# EAGLE design MaTouch ESP32-S3 Rotary IPS Display with Touch 2.1“ ST7701 v1.1 (EAGLE 6.1)
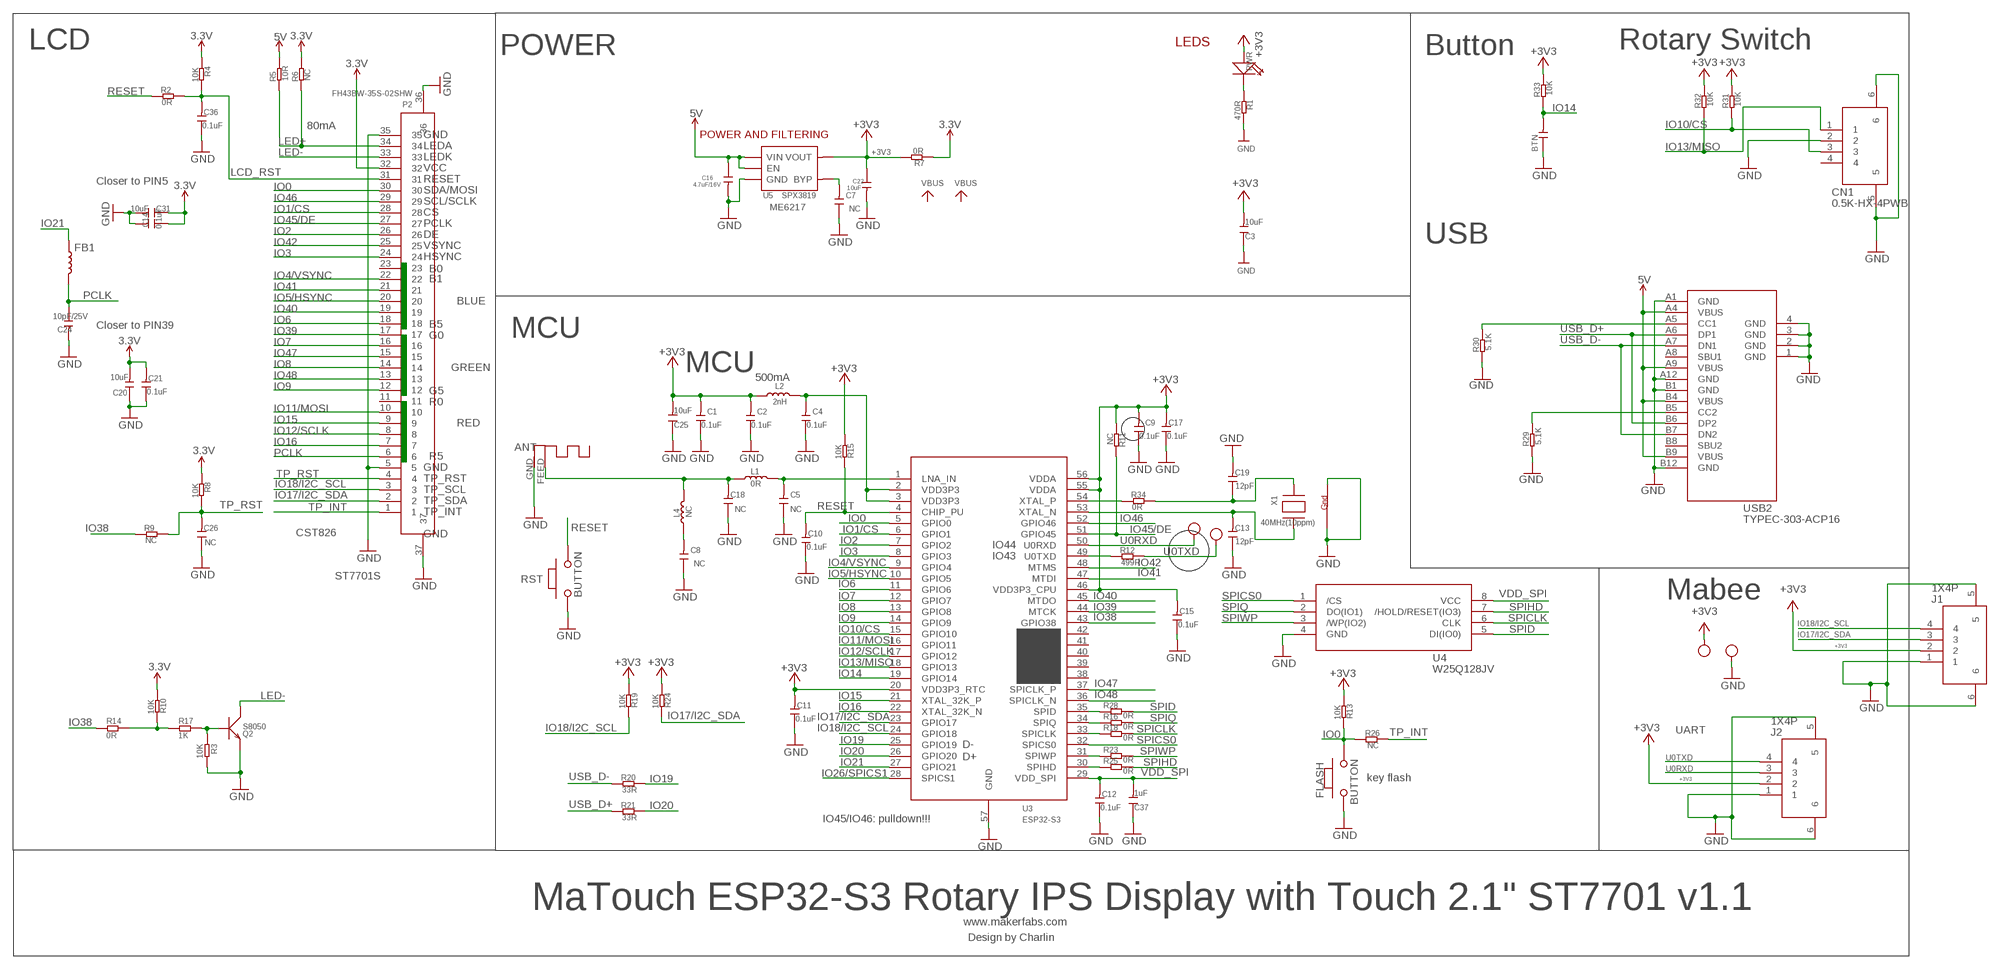
[diagram p0: schematic, sheet 1]

## Parts
3V3  TEST-POINT'4545'  [TP-D45MIL]
ANT1  ANTENNA  [RN-ANT]
BTN  C'5.08'  [CERAMIC-5.08]
C1  0.1uF  DISCRETE_C-0402  [DISCRETE_C0402]
C2  0.1uF  DISCRETE_C-0402  [DISCRETE_C0402]
C3  10uF  DISCRETE_C-0603  [DISCRETE_C0603]
C4  0.1uF  DISCRETE_C-0402  [DISCRETE_C0402]
C5  NC  DISCRETE_C-0402  [DISCRETE_C0402]
C7  NC  DISCRETE_C-0402  [DISCRETE_C0402]
C8  NC  DISCRETE_C-0402  [DISCRETE_C0402]
C9  0.1uF  DISCRETE_C-0402  [DISCRETE_C0402]
C10  0.1uF  DISCRETE_C-0402  [DISCRETE_C0402]
C11  0.1uF  DISCRETE_C-0402  [DISCRETE_C0402]
C12  0.1uF  DISCRETE_C-0402  [DISCRETE_C0402]
C13  12pF  DISCRETE_C-0402  [DISCRETE_C0402]
C14  0.1uF  DISCRETE_C-0402  [DISCRETE_C0402]
C15  0.1uF  DISCRETE_C-0402  [DISCRETE_C0402]
C16  4.7uF/16V  C-0603  [0603]
C17  0.1uF  DISCRETE_C-0402  [DISCRETE_C0402]
C18  NC  DISCRETE_C-0402  [DISCRETE_C0402]
C19  12pF  DISCRETE_C-0402  [DISCRETE_C0402]
C20  10uF  DISCRETE_C-0603  [DISCRETE_C0603]
C21  0.1uF  DISCRETE_C-0402  [DISCRETE_C0402]
C22  10uF  C-0603  [0603]
C24  10pF/25V  DISCRETE_C-0402  [DISCRETE_C0402]
C25  10uF  DISCRETE_C-0603  [DISCRETE_C0603]
C26  NC  DISCRETE_C-0402  [DISCRETE_C0402]
C31  10uF  DISCRETE_C-0603  [DISCRETE_C0603]
C36  0.1uF  DISCRETE_C-0402  [DISCRETE_C0402]
C37  1uF  DISCRETE_C-0603  [DISCRETE_C0603]
CN1  0.5K-HX-4PWB  [0.5K-HX-4PWB]
FB1  INDUCTORFB-30OHM  [0603]
FLASH  BUTTON  PB157  [157SW]
GND  TEST-POINT'4545'  [TP-D45MIL]
J1  1X4P  [1X4P-SMT1.25MM]
J2  1X4P  [1X4P-SMT1.25MM]
L1  0R  DISCRETE_L0402  [DISCRETE_L0402]
L2  2nH  DISCRETE_L0603  [DISCRETE_L0603]
L4  NC  DISCRETE_L0402  [DISCRETE_L0402]
P2  FH43BW-35S-02SHW  [1*35P-SMT0.4MM]
PWR  DISCRETE_LED0603  [DISCRETE_LED-0603]
Q2  S8050  TRANSISTOR-NPN-SOT23  [SOT23]
R1  470R  DISCRETE_R-0402  [DISCRETE_R0402]
R2  0R  DISCRETE_R-0402  [DISCRETE_R0402]
R3  10K  DISCRETE_R-0402  [DISCRETE_R0402]
R4  10K  DISCRETE_R-0402  [DISCRETE_R0402]
R5  10R  DISCRETE_R-0402  [DISCRETE_R0402]
R6  NC  DISCRETE_R-0402  [DISCRETE_R0402]
R7  0R  DISCRETE_R-0402  [DISCRETE_R0402]
R8  10K  DISCRETE_R-0402  [DISCRETE_R0402]
R9  NC  DISCRETE_R-0402  [DISCRETE_R0402]
R10  10K  DISCRETE_R-0402  [DISCRETE_R0402]
R11  NC  DISCRETE_R-0402  [DISCRETE_R0402]
R12  499R  DISCRETE_R-0402  [DISCRETE_R0402]
R13  10K  DISCRETE_R-0402  [DISCRETE_R0402]
R14  0R  DISCRETE_R-0402  [DISCRETE_R0402]
R15  10K  DISCRETE_R-0402  [DISCRETE_R0402]
R16  0R  DISCRETE_R-0402  [DISCRETE_R0402]
R17  1K  DISCRETE_R-0402  [DISCRETE_R0402]
R18  0R  DISCRETE_R-0402  [DISCRETE_R0402]
R19  10K  DISCRETE_R-0402  [DISCRETE_R0402]
R20  33R  DISCRETE_R-0402  [DISCRETE_R0402]
R21  33R  DISCRETE_R-0402  [DISCRETE_R0402]
R23  0R  DISCRETE_R-0402  [DISCRETE_R0402]
R24  10K  DISCRETE_R-0402  [DISCRETE_R0402]
R25  0R  DISCRETE_R-0402  [DISCRETE_R0402]
R26  NC  DISCRETE_R-0402  [DISCRETE_R0402]
R28  0R  DISCRETE_R-0402  [DISCRETE_R0402]
R29  5.1K  DISCRETE_R-0402  [DISCRETE_R0402]
R30  5.1K  DISCRETE_R-0402  [DISCRETE_R0402]
R31  10K  DISCRETE_R-0402  [DISCRETE_R0402]
R32  10K  DISCRETE_R-0402  [DISCRETE_R0402]
R33  10K  DISCRETE_R-0402  [DISCRETE_R0402]
R34  0R  DISCRETE_R-0402  [DISCRETE_R0402]
RST  BUTTON  PB157  [157SW]
RX  TEST-POINT'4545'  [TP-D45MIL]
TX  TEST-POINT'4545'  [TP-D45MIL]
U3  ESP32-S3  [QFN56-7*7MM]
U4  W25Q128JV  [SOIC-8-208MIL]
U5  SPX3819  [SOT23-5]
USB2  TYPEC-303-ACP16  [TYPEC-303-SMD16]
X1  40MHz(10ppm)  XTAL-4-3225  [NX3225]

## Nets
3.3V: C14.1 C20.2 C21.2 C31.1 P2.32 R4.2 R6.1 R7.2 R8.2 R10.2
5V: C16.1 R5.1 U5.1(VIN) U5.3(EN) USB2.A4(VBUS) USB2.A9(VBUS) USB2.B4(VBUS) USB2.B9(VBUS)
+3V3: 3V3.T C1.2 C2.2 C3.2 C9.2 C11.2 C15.2 C17.2 C22.1 C25.2 J1.2 J2.2 L2.1 PWR.+ R7.1 R11.2 R13.2 R15.2 R19.2 R24.2 R31.1 R32.1 R33.1 U3.20(VDD3P3_RTC) U3.46(VDD3P3_CPU) U3.55(VDDA) U3.56(VDDA) U5.5(VOUT)
GND: ANT1.GND BTN.1 C1.1 C2.1 C3.1 C4.1 C5.1 C7.1 C8.1 C9.1 C10.1 C11.1 C12.1 C13.1 C14.2 C15.1 C16.2 C17.1 C18.1 C19.2 C20.1 C21.1 C22.2 C24.2 C25.1 C26.1 C31.2 C36.1 C37.1 CN1.2 CN1.5 CN1.6 FLASH.1 GND.T J1.1 J1.5 J1.6 J2.1 J2.5 J2.6 P2.5 P2.35 P2.36 P2.37 Q2.2(E) R1.1 R3.1 R29.2 R30.2 RST.1 U3.57(GND) U4.4(GND) U5.2(GND) USB2.1(GND) USB2.2(GND) USB2.3(GND) USB2.4(GND) USB2.A1(GND) USB2.A12(GND) USB2.B1(GND) USB2.B12(GND) X1.2(G2) X1.4(G1)
IO0: FLASH.2 P2.30 R13.1 R26.2 U3.5(GPIO0)
IO1/CS: P2.28 U3.6(GPIO1)
IO2: P2.26 U3.7(GPIO2)
IO3: P2.24 U3.8(GPIO3)
IO4/VSYNC: P2.22 U3.9(GPIO4)
IO5/HSYNC: P2.20 U3.10(GPIO5)
IO6: P2.18 U3.11(GPIO6)
IO7: P2.16 U3.12(GPIO7)
IO8: P2.14 U3.13(GPIO8)
IO9: P2.12 U3.14(GPIO9)
IO10/CS: CN1.3 R31.2 U3.15(GPIO10)
IO11/MOSI: P2.10 U3.16(GPIO11)
IO12/SCLK: P2.8 U3.17(GPIO12)
IO13/MISO: CN1.1 R32.2 U3.18(GPIO13)
IO14: BTN.2 R33.2 U3.19(GPIO14)
IO15: P2.9 U3.21(XTAL_32K_P)
IO16: P2.7 U3.22(XTAL_32K_N)
IO17/I2C_SDA: J1.3 P2.2 R24.1 U3.23(GPIO17)
IO18/I2C_SCL: J1.4 P2.3 R19.1 U3.24(GPIO18)
IO19: R20.1 U3.25(GPIO19)
IO20: R21.1 U3.26(GPIO20)
IO21: FB1.1 U3.27(GPIO21)
IO26/SPICS1: U3.28(SPICS1)
IO38: R9.2 R14.2 U3.43(GPIO38)
IO39: P2.17 U3.44(MTCK)
IO40: P2.19 U3.45(MTDO)
IO41: P2.21 U3.47(MTDI)
IO42: P2.25 U3.48(MTMS)
IO45/DE: P2.27 R11.1 U3.51(GPIO45)
IO46: P2.29 U3.52(GPIO46)
IO47: P2.15 U3.37(SPICLK_P)
IO48: P2.13 U3.36(SPICLK_N)
LCD_RST: C36.2 P2.31 R2.1 R4.1
LED+: P2.34 R5.2 R6.2
LED-: P2.33 Q2.3(C)
N$1: ANT1.FEED C18.2 L1.1 L4.2
N$2: C5.2 L1.2 U3.1(LNA_IN)
N$3: R28.2 U3.35(SPID)
N$4: C8.2 L4.1
N$6: R10.1 R14.1 R17.2
N$7: PWR.- R1.2
N$8: Q2.1(B) R3.2 R17.1
N$9: R30.1 USB2.A5(CC1)
N$10: R29.1 USB2.B5(CC2)
N$33: C4.2 L2.2 U3.2(VDD3P3) U3.3(VDD3P3)
N$35: R16.2 U3.34(SPIQ)
N$37: R34.2 U3.54(XTAL_P)
N$38: R18.2 U3.33(SPICLK)
N$40: R23.2 U3.31(SPIWP)
N$41: R25.2 U3.30(SPIHD)
N$63: R12.2 U3.49(U0TXD)
N$65: C13.2 U3.53(XTAL_N) X1.3(X2)
N$66: C19.1 R34.1 X1.1(X1)
N$76: C7.2 U5.4(BYP)
PCLK: C24.1 FB1.2 P2.6
RESET: C10.2 R2.2 R15.1 RST.2 U3.4(CHIP_PU)
SPICLK: R18.1 U4.6(CLK)
SPICS0: U3.32(SPICS0) U4.1(/CS)
SPID: R28.1 U4.5(DI(IO0))
SPIHD: R25.1 U4.7(/HOLD/RESET(IO3))
SPIQ: R16.1 U4.2(DO(IO1))
SPIWP: R23.1 U4.3(/WP(IO2))
TP_INT: P2.1 R26.1
TP_RST: C26.2 P2.4 R8.1 R9.1
U0RXD: J2.3 RX.T U3.50(U0RXD)
U0TXD: J2.4 R12.1 TX.T
USB_D+: R21.2 USB2.A6(DP1) USB2.B6(DP2)
USB_D-: R20.2 USB2.A7(DN1) USB2.B7(DN2)
VDD_SPI: C12.2 C37.2 U3.29(VDD_SPI) U4.8(VCC)
Unconnected: CN1.4 P2.11 P2.23 U3.38(GPIO33) U3.39(GPIO34) U3.40(GPIO35) U3.41(GPIO36) U3.42(GPIO37) USB2.A8(SBU1) USB2.B8(SBU2)

## Notes on the sheet
- LCD | LEDS | Rotary Switch
- POWER | Button
- 80mA
- GND | POWER AND FILTERING
- LEDA
- LEDK
- VCC
- Closer to PIN5 | RESET
- SDA/MOSI
- SCL/SCLK
- ME6217
- CS
- PCLK
- DE
- USB
- VSYNC
- HSYNC
- B0
- B1
- BLUE
- Closer to PIN39 | B5
- G0 | MCU
- GREEN | MCU
- 500mA
- G5
- R0
- RED
- ANT
- R5
- GND
- TP_RST
- TP_SCL
- TP_SDA
- TP_INT
- CST826 | GND
- IO44
- IO43
- ST7701S
- Mabee
- UART
- D-
- D+
- key flash
- IO45/IO46: pulldown!!!
- MaTouch ESP32-S3 Rotary IPS Display with Touch 2.1" ST7701 v1.1
- www.makerfabs.com
- Design by Charlin

## Library data of the parts
3V3 GND RX TX = Discrete-new:TEST-POINT; PARTNO: DNP
ANT1 = adafruit:ANTENNA
BTN C16 C22 = Discrete:C*: Ceramic Capacitors
C1-C5 C7-C15 C17-C21 C24-C26 C31 C36 C37 = A9G:DISCRETE_C*: Ceramic Capacitors
CN1 = sale:0.5K-HX-4PWB
FB1 = SparkFun-Coils:INDUCTOR: Inductors Resist changes in electrical current. Basically a coil of wire. SparkFun Products: SparkFun Load Cell Amplifier - HX711 <https://www.sparkfun.com/products/13879> IOIO-OTG - V2.2 <https://www.sparkfun.com/products/13613>; PROD_ID: NDUC-07859
FLASH RST = MySMD:PB157
J1 J2 = sale:1X4P
L1 L2 L4 = A9G:DISCRETE_L*
P2 = sale:FH43BW-35S-02SHW
PWR = A9G:DISCRETE_LED*
Q2 = Discrete:TRANSISTOR-NPN*: NPN audion
R1-R21 R23-R26 R28-R34 = A9G:DISCRETE_R*
U3 = sale:ESP32-S3
U4 = self:W25Q128JV
U5 = IC:SPX3819
USB2 = sale:TYPEC-303-ACP16
X1 = adafruit:XTAL-4: Classic 4-pin 3.2 x 2.5mm crystal

## Net classes
0 default: width 0.203 mm, drill 0.305 mm, clearance 0.152 mm
1 vbat: width 0.254 mm, drill 0.305 mm, clearance 0.203 mm

## Board
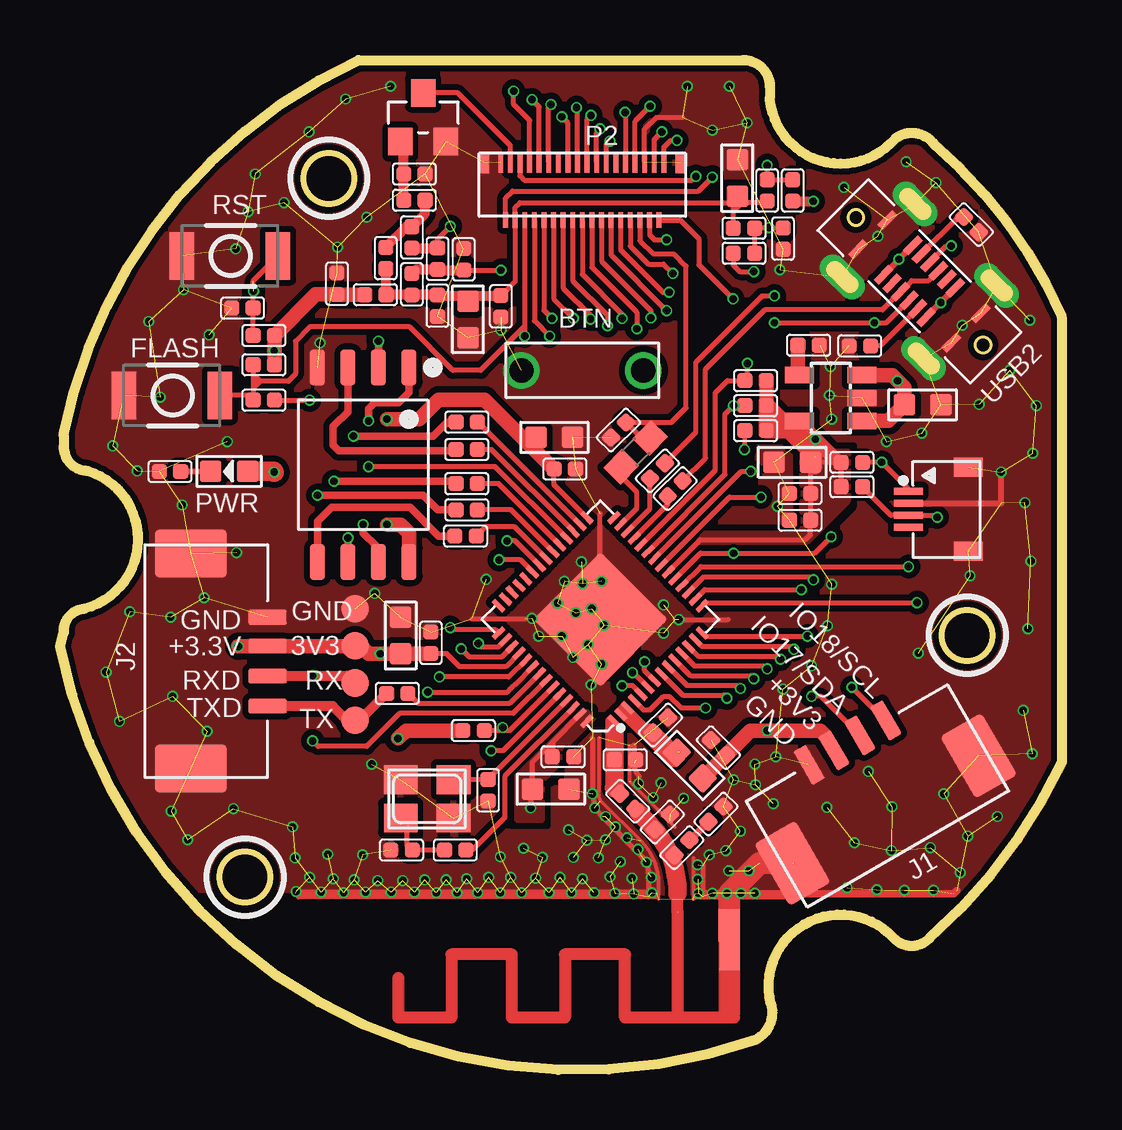
[diagram p1: board, top side]
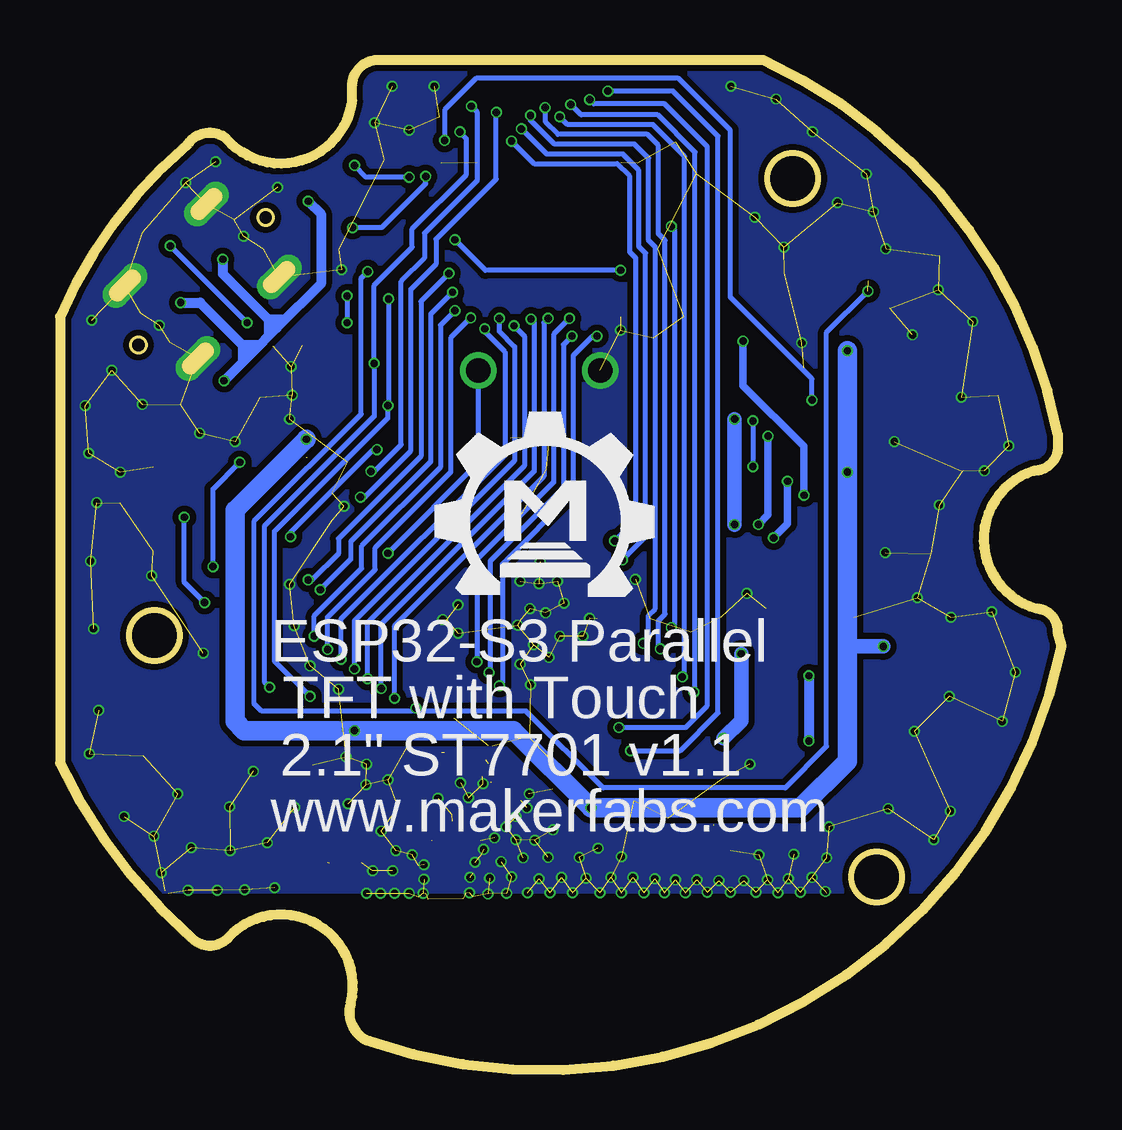
[diagram p2: board, bottom side, seen from below]

Size 41.75 x 42.08 mm. Coordinates in mm from the lower left corner, seen from the top.
Outline: 29.59,40.49 29.59,40.98 arc90 28.49,42.08 12.44,42.08 arc54 0.15,26.48
Outline: 29.58,40.45 arc134 34.84,38.83 arc-89 36.41,38.6 arc-26 41.75,31.39 41.75,12.79 arc-23 36.24,5.48
Outline: 36.24,5.48 arc-90 34.76,5.48 arc152 29.63,2.76 arc-79 29.02,1.27 arc-98 0,17.65 0.16,18.23 arc-90 1.03,19.22 arc147 1.16,24.96 arc-90 0.15,25.98 0.15,26.46
Outline: circle at 7.71,8.03 radius 1.05
Outline: circle at 11.21,37.15 radius 1.05
Outline: circle at 37.81,18.1 radius 1.05
Copper layers (1*16): Top 0.035mm / dielectric 1.5mm / Bottom 0.035mm
Design rules: minimum track width 6mil, minimum drill 10mil, track to track 6mil, track to pad 6mil, pad to pad 6mil, via to via 6mil, smd to smd 0mil, copper to edge 10mil, drill to drill 10mil, minimum pad ring 3mil, minimum via ring 3mil, stop-mask expansion 2mil, vias tented up to drill 100mil, thermal gap 0mil
tRestrict: area 0.2,-0.3 to 46.2,7.1
bRestrict: area 0.2,-0.3 to 46.2,7.1

### Footprints (pad centres in the part's own frame; a part is rotated, then mirrored left to right if it is on the bottom)
TP-D45MIL = smd 1.143 x 1.143: T 0,0
RN-ANT = smd 0.025 x 0.025: FEED 0,2.159 | smd 2.54 x 0.889: GND -1.143,0
CERAMIC-5.08 = drill 1.016: 1 -2.54,0; 2 2.54,0
DISCRETE_C0402 = smd 0.635 x 0.635: 1 -0.445,0; 2 0.445,0
DISCRETE_C0603 = smd 0.889 x 0.889: 1 -0.762,0; 2 0.762,0
0603 = smd 0.889 x 0.889: 1 -0.762,0; 2 0.762,0
0.5K-HX-4PWB = smd 0.3 x 1.2: 1 0.75,0; 2 0.25,0; 3 -0.25,0; 4 -0.75,0 | smd 0.8 x 1.2: 5 -1.75,-2.5; 6 1.75,-2.5
0603' = smd 1.1 x 1: 1 -0.85,0; 2 0.85,0
157SW = smd 1.016 x 1.981: 1 0,0; 2 4,0
1X4P-SMT1.25MM = smd 0.6 x 1.6: 1 -1.825,2.54; 2 -0.625,2.54; 3 0.625,2.54; 4 1.875,2.54 | smd 2 x 3: 5 4.475,-0.66; 6 -4.475,-0.66
DISCRETE_L0402 = smd 0.635 x 0.635: 1 -0.445,0; 2 0.445,0
DISCRETE_L0603 = smd 0.889 x 0.889: 1 -0.762,0; 2 0.762,0
1*35P-SMT0.4MM = smd 0.2 x 0.87: 1 -3.4,-1.26; 3 -3,-1.26; 5 -2.6,-1.26; 7 -2.2,-1.26; 9 -1.8,-1.26; 11 -1.4,-1.26; 13 -1,-1.26; 15 -0.6,-1.26; 17 -0.2,-1.26; 19 0.2,-1.26; 21 0.6,-1.26; 23 1,-1.26; 25 1.4,-1.26; 27 1.8,-1.26; 29 2.2,-1.26; 31 2.6,-1.26; 33 3,-1.26; 35 3.4,-1.26 | smd 0.2 x 0.65: 2 -3.2,1.15; 4 -2.8,1.15; 6 -2.4,1.15; 8 -2,1.15; 10 -1.6,1.15; 12 -1.2,1.15; 14 -0.8,1.15; 16 -0.4,1.15; 18 0,1.15; 20 0.4,1.15; 22 0.8,1.15; 24 1.2,1.15; 26 1.6,1.15; 28 2,1.15; 30 2.4,1.15; 32 2.8,1.15; 34 3.2,1.15 | smd 0.4 x 0.9: 36 -4.085,-1.245; 37 4.085,-1.245
DISCRETE_LED-0603 = smd 0.889 x 0.889: + -0.762,0; - 0.762,0
SOT23 = smd 1.016 x 1.143: 1 -0.95,-1.016; 2 0.95,-1.016; 3 0,1.016
DISCRETE_R0402 = smd 0.635 x 0.635: 1 -0.445,0; 2 0.445,0
QFN56-7*7MM = smd 0.6 x 0.2: 1 -3.4,2.6; 2 -3.4,2.2; 3 -3.4,1.8; 4 -3.4,1.4; 5 -3.4,1; 6 -3.4,0.6; 7 -3.4,0.2; 8 -3.4,-0.2; 9 -3.4,-0.6; 10 -3.4,-1; 11 -3.4,-1.4; 12 -3.4,-1.8; 13 -3.4,-2.2; 14 -3.4,-2.6; 29 3.4,-2.6; 30 3.4,-2.2; 31 3.4,-1.8; 32 3.4,-1.4; 33 3.4,-1; 34 3.4,-0.6; 35 3.4,-0.2; 36 3.4,0.2; 37 3.4,0.6; 38 3.4,1; 39 3.4,1.4; 40 3.4,1.8; 41 3.4,2.2; 42 3.4,2.6 | smd 0.2 x 0.6: 15 -2.6,-3.4; 16 -2.2,-3.4; 17 -1.8,-3.4; 18 -1.4,-3.4; 19 -1,-3.4; 20 -0.6,-3.4; 21 -0.2,-3.4; 22 0.2,-3.4; 23 0.6,-3.4; 24 1,-3.4; 25 1.4,-3.4; 26 1.8,-3.4; 27 2.2,-3.4; 28 2.6,-3.4; 43 2.6,3.4; 44 2.2,3.4; 45 1.8,3.4; 46 1.4,3.4; 47 1,3.4; 48 0.6,3.4; 49 0.2,3.4; 50 -0.2,3.4; 51 -0.6,3.4; 52 -1,3.4; 53 -1.4,3.4; 54 -1.8,3.4; 55 -2.2,3.4; 56 -2.6,3.4 | smd 4 x 4: 57 0,0
SOIC-8-208MIL = smd 1.5 x 0.635: 1 -4.05,1.905; 2 -4.05,0.635; 3 -4.05,-0.635; 4 -4.05,-1.905; 5 4.05,-1.905; 6 4.05,-0.635; 7 4.05,0.635; 8 4.05,1.905
SOT23-5 = smd 0.69 x 1.2: 1 -0.95,-1.3; 2 0,-1.3; 3 0.95,-1.3; 4 0.95,1.3; 5 -0.95,1.3
TYPEC-303-SMD16 = drill 0.6 pad 1.1 long: 1 -2.4,2.15; 2 2.4,2.15; 3 -2.4,-2.15; 4 2.4,-2.15 | smd 0.3 x 0.87: A1 -2.75,0.865; A4 -1.25,0.865; A5 -0.75,0.865; A6 -0.25,0.865; A7 0.25,0.865; A8 0.75,0.865; A9 1.25,0.865; A12 2.75,0.865; B1 2.75,-0.865; B4 1.25,-0.865; B5 0.75,-0.865; B6 0.25,-0.865; B7 -0.25,-0.865; B8 -0.75,-0.865; B9 -1.25,-0.865; B12 -2.75,-0.865
NX3225 = smd 1.4 x 1.2: 1 -1.1,-0.8; 2 1.1,-0.8; 3 1.1,0.8; 4 -1.1,0.8

### Placement (x,y rotation side)
3V3  12.31,17.67 0 top
ANT1  27.9,6.57 90 top
BTN  21.78,29.15 0 top
C1  20.97,13.05 180 top
C2  30.85,22.9 0 top
C3  30.52,25.32 0 top
C4  25.03,14.37 225 top
C5  23.56,12.92 180 top
C7  31.21,30.19 180 top
C8  27.35,10.66 225 top
C9  27.45,13.43 315 top
C10  7.61,31.74 0 top
C11  30.85,24.02 0 top
C12  21.05,25.04 180 top
C13  17.85,11.65 90 top
C14  18.38,31.82 270 top
C15  11.55,32.76 270 top
C16  35.96,27.71 0 top
C17  15.46,17.8 270 top
C18  25.11,10.33 225 top
C19  14.24,9.16 180 top
C20  17.01,31.28 90 top
C21  15.74,31.84 90 top
C22  14.2,18.1 90 top
C24  23.28,26.66 225 top
C25  20.46,11.7 180 top
C26  16.83,33.77 270 top
C31  28.24,37.16 90 top
C36  30.14,34.64 90 top
C37  20.61,26.36 180 top
CN1  35.36,23.36 90 top
FB1  [0603']  24,25.74 45 top
FLASH  2.67,28.1 0 top
GND  12.31,19.22 0 top
J1  34.08,11.42 30 top
J2  6.11,17.04 270 top
L1  23.66,11.19 135 top
L2  26.25,12.69 135 top
L4  25.92,9.26 225 top
P2  21.77,36.56 180 top
PWR  7.05,24.94 180 top
Q2  15.14,39.69 0 top
R1  4.59,24.94 0 top
R2  28.51,34.03 180 top
R3  14.77,37.33 180 top
R4  28.51,35.07 180 top
R5  30.55,36.64 90 top
R6  29.48,36.64 90 top
R7  13.15,32.3 0 top
R8  14.67,32.73 270 top
R9  15.74,33.8 90 top
R10  13.58,33.83 270 top
R11  17.24,14.14 180 top
R12  14.06,15.69 0 top
R13  8.5,29.38 0 top
R14  14.67,34.69 270 top
R15  8.5,30.6 0 top
R16  16.96,23.34 0 top
R17  14.77,36.24 0 top
R18  16.96,24.43 0 top
R19  29,28.72 0 top
R20  25.64,24.22 45 top
R21  24.91,24.96 45 top
R23  16.96,25.85 0 top
R24  29,27.68 0 top
R25  16.96,26.99 0 top
R26  8.5,27.91 180 top
R28  16.91,22.24 0 top
R29  37.99,35.22 315 top
R30  33.34,30.17 180 top
R31  33.01,24.3 0 top
R32  33.01,25.32 0 top
R33  29,26.64 180 top
R34  16.47,9.16 0 top
RST  5.09,33.91 0 top
RX  12.31,16.12 0 top
TX  12.31,14.57 0 top
U3  22.53,18.77 135 top
U4  12.64,25.21 270 top
U5  32.13,28 90 top
U$1  [MAKERFABS_0.3]  25.65,19.79 0 bottom
USB2  35.83,32.86 135 top
X1  15.31,11.3 0 top

### Tracks (layer width: path | path; a pad name or v marks a point on that pad's centre or on a via)
3.3V
  Top 0.203: C14.1 18.97,32.86 P2.32 18.97,35.94 19.17,36.14 28.42,36.14 | 13.6,32.29 R7.2 | 13.59,33.37 R10.2 | C21.2 15.76,32.26 | C20.2 17.08,32.11 17.08,32.26 | R6.1 29.42,36.14 28.42,36.14 | R4.2 28.07,35.78 | 28.07,35.78 28.07,36.23 C31.1 | 28.42,36.14 28.07,35.78
  Top 0.406: C21.2 R8.2 13.6,32.29 | R7.2 13.59,33.37 | 15.76,32.26 17.08,32.26 C14.1
5V  (via drill 0.3)
  Top 0.254: USB2.B4 v34.98,33.77 v34.97,33.77 | USB2.A4 36.71,31.97 v36.72,31.97 | v34.91,28.72 34.9,28.73
  Top 0.279: USB2.A4 USB2.B9 | USB2.A9 USB2.B4
  Top 0.406: R5.1 v31.4,36.2
  Top 0.61: U5.1 34.54,27.05 C16.1 35.2,28.44 34.9,28.73 34.69,28.95 U5.3
  Bottom 0.406: v31.4,36.2 30.88,35.67 30.88,32.75 32.72,30.91 | 32.72,30.91 33.78,29.85 | 33.78,29.85 v34.91,28.72 | v34.97,33.77 34.97,33.16 33.06,31.26 | 33.06,31.26 32.72,30.91 | v36.72,31.97 35.91,31.97 34.13,30.19 | 34.13,30.19 33.78,29.85 | 32.37,31.26 33.06,31.26 | 33.06,31.26 33.06,30.57 | 33.47,30.19 34.13,30.19 | 34.13,30.19 34.13,29.53
+3V3  (via drill 0.3)  (1 unrouted)
  Top 0.203: U3.20 26.7,22.09 31.08,22.09 31.28,22.29 31.28,22.89 C2.2 C11.2 31.29,25.3 C3.2 R32.1 R31.1 | U3.46 18.58,16.81 16.65,16.81 16.12,17.34 15.47,17.34 C17.2 | C22.1 | U3.55 20.53,13.66 | 20.53,13.66 C1.2 | v19.62,10.91 19.62,11.63 C25.2 19.7,12.83 20.53,13.66 | U5.5 30.98,26.91
  Top 0.61: v8.93,29.96 8.94,29.98 R15.2 | 15.47,17.34 C22.1 | v13.35,17.34 12.87,17.34 12.54,17.67 3V3.T 12.3,17.66 J2.2 7.45,17.66 v7.43,17.65 | v13.35,17.34 C22.1 v13.35,17.34 | R13.2 R15.2 | R15.2 10.66,32.31 C15.2 11.56,32.3 R7.1 | R11.2 14.42,14.14 v14.09,13.81 | R19.2 R24.2 29.44,27.17 | 29.44,27.17 R33.1 | U5.5 29.56,27.05 29.44,27.17 | 30.98,26.91 30.98,26.79 v31.49,26.28 31.49,25.52 C3.2 | 31.46,25.11 31.46,25.52 30.37,26.61 29.43,26.61 29.43,27.78 | 29.43,27.86 29.43,27.78 | 29.43,27.78 30.39,26.81 30.95,26.81 32.27,25.49 | L2.1 C9.2 28.79,14.14 v29.48,14.14 | v29.48,14.14 30.14,14.14 | v29.48,14.14 31.69,14.14 31.89,13.94 J1.2
  Top 0.813: PWR.+ 8.9,24.94 v8.93,24.91
  Bottom 0.61: v7.43,17.65 8.9,17.65 8.93,17.62 | v14.09,13.81 13.35,14.55 v13.35,17.34
  Bottom 0.813: v8.93,29.96 v8.93,24.91 8.93,17.62 8.93,12.87 10.89,10.91 v19.62,10.91 22.85,14.14 v29.48,14.14 34.08,14.14 34.46,14.52 34.46,23.31 v31.49,26.28
  pour Top: 21.81,15.08 19.04,12.31 19.04,10.41 20.11,10.41 20.11,12.03 20.84,12.77 20.84,13.25 22.24,14.65
  pour Top: 30.9,25.77 30.9,22.62 30.65,22.37 26.89,22.37 26.61,22.09 26.61,21.99 31.16,21.99 32.88,23.72 32.88,25.77
GND  (via drill 0.3)  (245 unrouted)
  Top 0.152: 22.47,13.84 22.47,11.4 arc45 22.54,11.22 24.21,9.55 arc-45 24.96,7.75 24.96,7.13 | 23.79,11.98 25.41,10.36 25.41,10.33 25.64,10.1 | 23.76,12.01 arc-90 23.74,12.08 23.74,13.51 23.92,13.51 23.92,13.53 | 26.41,8.83 26.41,7.1
  Top 0.203: P2.5 24.37,39.21 24.86,39.69 25.95,39.69 | U3.57 22.52,23.18 | 25.64,18.76 27.85,18.76 | 17.16,18.79 19.37,18.79 | 22.19,13.84 v22.19,11.5 | 22.21,11.5 arc45 22.61,10.54 24.22,8.93 arc-45 24.53,8.2 24.53,7.21 | 23.92,13.53 23.92,12.79 arc45 24.14,12.24 | 26.81,8.52 26.81,7.21 | 24.91,7.21 9.95,7.21 | 26.43,7.21 30.39,7.21
  Top 0.254: CN1.2 39.23,23.61 v39.23,24.91
  Top 0.305: 9.79,7.36 24.86,7.36 | 26.48,7.33 37.25,7.33 37.38,7.46
  Top 0.914: ANT1.GND 27.9,7.36 29.17,8.63 30.6,8.63
  other vias: 8.14,37.33 35.27,37.84 3.7,31.18 11.9,40.45 26.15,40.99 40.71,27.68 40.48,21.2 4.69,15.56 1.92,16.58 2.2,26 5.32,9.59 40.35,18.38 40.55,25.7 36.52,36.97 40.15,14.98 32.17,27.12 3.22,24.96 5.1,23.54 29.91,23.49 40.22,23.64 18.38,30.83 10.84,30.29 11.57,34.28 13.12,19.86 17.77,20.44 19.67,18.81 20.92,18.08 21.78,20.26 25.16,19.37 21.5,19.04 22.57,16.91 21.38,17.19 22.16,19.22 22.01,17.72 25.16,18.2 22.57,20.36 20.74,19.45 22.67,18.53 30.01,33.34 27.19,39.16 4.64,10.79 35.93,26.54 21.02,20.36 28.08,12.08 21.2,10 34.69,10.97 33.11,9.47 29.73,11.09 30.14,15.87 31.99,18.51 32.17,20.24 38.32,27.73 39.59,29.15 28.64,39.46 27.9,40.99 32.07,28.11 26,11.32 12.79,35.53 18.35,8.88 6.14,14.11 7.23,10.89 9.79,8.83 11.17,8.98 12.99,12.74 4.61,18.86 7.33,34.21 6.21,30.62 4.18,28.03 7.36,21.56 10.38,39.08 13.78,40.99 35.78,17.37 31.33,16.83 36.85,11.5 36.29,9.26 12.61,8.96 24.73,11.35 21.4,8.86 6.01,19.68 27.19,7.36 20.11,8.86 6.97,26.18 7.84,35.76 22.14,16.05 25.8,18.76 31.97,10.94 9.34,36.14 9.69,10.13 2.48,14.52 33.7,12.44 37.84,9.75 2.91,19.09 5.15,32.5 40.53,13.18 19.95,18.08 21.73,21.18 32.12,29.3 32.68,36.77 34.1,34.74 37.61,31.03 40.43,31.23 34.46,26.18 37.94,20.59 27.75,9.14 28.97,7.36 28.39,7.36 27.88,8.3 28.72,8.3 24.68,7.38 26.61,7.36 23.13,7.36 22.27,7.38 21.33,7.38 20.39,7.38 19.24,7.38 18.35,7.38 17.41,7.38 16.55,7.38 15.69,7.38 14.77,7.41 13.81,7.41 12.74,7.41 11.83,7.38 10.89,7.41 9.85,7.43 23.92,7.33 24.65,8.02 24.09,9.19 23.64,9.67 23.15,10.13 22.29,10.91 24.12,11.93 27.07,8.96 26.58,7.94 23.84,7.99 21.78,7.97 20.84,8.02 19.83,7.99 18.79,8.02 17.87,8.02 16.96,7.97 16.09,7.92 15.2,7.92 14.29,7.89 13.25,7.89 12.26,7.92 11.39,7.97 10.4,8.02 28.36,9.95 29.83,13.05 28.97,12.74 29,11.88 19.32,9.24 34.05,7.51 32.81,7.59 35.19,7.49 36.41,7.49 37.53,8.22 39.08,10.56 34.66,9.14 23.36,8.68 22.75,9.59 21.96,9.57 24.45,8.65 22.93,8.04 22.44,8.83 27.8,7.36 26.58,8.55 22.75,10.56 25.06,11.96
  pour Top (isolate 0.254, rank 6): -10.01,84.99 -10.01,-5.01 84.99,-5.01 84.99,84.99
  pour Bottom (isolate 0.254, rank 6): -11.01,-5.01 84.99,-5.01 84.99,84.99 -11.01,84.99
  pour Top (isolate 0.152, rank 6): 21.58,13.96 26.66,13.96 26.66,6.6 21.58,6.6
IO0  (via drill 0.3)
  Top 0.203: P2.30 19.37,30.98 | 19.37,30.98 v19.37,30.58 v19.37,30.57 | R13.1 8.05,28.72 | 8.05,28.72 R26.2 7.86,28.1 FLASH.2 | 8.35,28.69 9.51,28.69 9.82,29 9.82,30.37 10.4,30.96 14.57,30.96 16.37,29.15 17.54,29.15 19.37,30.98 | 8.35,28.69 8.08,28.69 8.05,28.72 | 8.07,28.97 8.35,28.69 | 8.35,28.69 8.07,28.42 | U3.5 23.88,16.01 v23.43,16.01
  Bottom 0.203: v19.37,30.57 19.55,30.57 20.36,29.76 20.36,24.02 23.31,21.07 23.31,16.13 v23.43,16.01
IO1/CS  (via drill 0.3)
  Top 0.203: P2.28 19.77,31.21 v20.41,30.57 | U3.6 23.9,16.55 v23.87,16.55
  Bottom 0.203: v20.41,30.57 20.77,30.22 20.77,24.25 23.81,21.2 23.81,16.6 v23.87,16.55
IO2  (via drill 0.3)
  Top 0.203: P2.26 20.17,31.65 v20.51,31.31 | U3.7 24.37,16.64 v24.37,17.01
  Bottom 0.203: v20.51,31.31 21.17,30.65 21.17,24.48 24.37,21.28 v24.37,17.01
IO3  (via drill 0.3)
  Top 0.203: P2.24 20.57,32.14 v21.4,31.31 | U3.8 25.97,15.61 27.68,15.61 v27.8,15.49
  Bottom 0.203: v21.4,31.31 21.58,31.13 21.58,24.73 27.8,18.51 v27.8,15.49
IO4/VSYNC  (via drill 0.3)
  Top 0.203: P2.22 20.97,32.58 22.11,31.44 v22.11,31.29 | U3.9 26.13,16.02 28.23,16.02 v28.36,15.89
  Bottom 0.203: v22.11,31.29 21.99,31.16 21.99,24.94 28.36,18.56 v28.36,15.89
IO5/HSYNC  (via drill 0.3)
  Top 0.203: P2.20 21.37,32.89 22.82,31.44 v22.82,31.01 | U3.10 26.29,16.43 28.79,16.43 v28.92,16.3
  Bottom 0.203: v22.82,31.01 22.39,30.57 22.39,25.16 28.92,18.64 v28.92,16.3
IO6  (via drill 0.3)
  Top 0.203: P2.18 21.77,33.15 23.43,31.49 v23.43,31.31 | U3.11 26.45,16.83 29.35,16.83 v29.48,16.71
  Bottom 0.203: v23.43,31.31 23.43,30.78 22.8,30.14 22.8,25.39 29.48,18.71 v29.48,16.71
IO7  (via drill 0.3)
  Top 0.203: P2.16 22.17,33.43 24.04,31.56 v24.04,30.88 | U3.12 26.6,17.24 29.91,17.24 v30.04,17.11
  Bottom 0.203: v24.04,30.88 24.04,30.75 23.21,29.91 23.21,25.62 30.04,18.79 v30.04,17.11
IO8  (via drill 0.3)
  Top 0.203: P2.14 22.57,33.7 24.63,31.64 v24.63,31.34 | U3.13 26.76,17.65 30.47,17.65 v30.6,17.52
  Bottom 0.203: v24.63,31.34 25.47,30.5 25.47,24.91 28.62,21.76 28.62,20.85 30.6,18.86 v30.6,17.52
IO9  (via drill 0.3)
  Top 0.203: P2.12 22.97,33.96 v25.29,31.64 | U3.14 26.9,18.08 v31.16,18.08
  Bottom 0.203: v25.29,31.64 25.9,31.03 25.9,25.11 29.17,21.84 29.17,20.9 31.16,18.92 v31.16,18.08
IO10/CS  (via drill 0.3)
  Top 0.203: 33.47,24.32 R31.2 34.64,23.11 CN1.3 36.46,23.11 36.57,23 v36.57,23.03 | U3.15 26.91,19.47 v35.73,19.47
  Bottom 0.203: v35.73,19.47 36.57,20.31 v36.57,23.03
IO11/MOSI  (via drill 0.3)
  Top 0.203: P2.10 23.37,34.17 25.14,32.4 v25.39,32.4 | U3.16 26.88,20.01 v30.9,20.01
  Bottom 0.203: v25.39,32.4 26.3,31.49 26.3,25.34 29.63,22.01 29.63,21.28 v30.9,20.01
IO12/SCLK  (via drill 0.3)
  Top 0.203: P2.8 23.77,34.32 24.53,33.57 25.16,33.57 v25.54,33.19 | U3.17 26.84,20.54 31.28,20.54 v31.41,20.41
  Bottom 0.203: v25.54,33.19 26.71,32.02 26.71,25.57 30.14,22.14 30.14,21.51 31.23,20.41 v31.41,20.41
IO13/MISO  (via drill 0.3)
  Top 0.203: U3.18 26.71,20.97 v35.37,20.97 | R32.2 v34.25,25.32 35.36,24.21 CN1.1
  Bottom 0.203: v35.37,20.97 35.37,24.2 v34.25,25.32
IO14  (via drill 0.3)
  Top 0.203: U3.19 26.7,21.53 v28.08,21.53 31.46,21.53 v32.15,22.22 | R33.2 v28.54,25.85
  Bottom 0.203: BTN.2 24.32,25.3 v28.08,21.53 | v32.15,22.22 32.15,22.4 28.69,25.85 v28.54,25.85
IO15  (via drill 0.3)
  Top 0.203: U3.21 27.91,23.87 v29.22,23.87 | v23.56,39.9 23.57,39.88 P2.9
  Bottom 0.203: v29.22,23.87 29.05,23.87 27.12,25.8 27.12,32.53 26.08,33.57 26.08,34.61 23.57,37.11 23.57,39.88 v23.56,39.9
IO16  (via drill 0.3)
  Top 0.203: U3.22 28.41,24.94 v28.79,24.94 | P2.7 23.97,39.52 v24.6,40.15
  Bottom 0.203: v28.79,24.94 28.64,24.94 27.52,26.05 27.52,32.86 26.56,33.83 26.56,34.87 24.35,37.08 24.35,39.9 v24.6,40.15
IO17/I2C_SDA  (via drill 0.3)
  Top 0.203: U3.23 27.73,24.82 27.73,27.32 v28.08,27.68 R24.1 | P2.2 25.86,35.41 26.63,34.64 26.63,33.55 v28.06,32.12 | J1.3 31.72,15.56 v31.33,15.56
  Bottom 0.203: v28.06,32.12 28.06,27.7 v28.08,27.68 28.08,27.17 32.81,22.45 32.81,17.04 v31.33,15.56
IO18/I2C_SCL  (via drill 0.3)
  Top 0.203: P2.3 24.77,38.77 v25.08,39.08 | U3.24 27.32,24.98 27.32,28.21 27.83,28.72 R19.1 28.66,28.83 v28.66,29.44 | v33.01,15.94 34.39,14.56 J1.4
  Bottom 0.203: v25.08,39.08 24.81,38.8 24.81,37.31 27.07,35.04 27.07,34.28 28.66,32.69 v28.66,29.44 28.66,27.23 33.21,22.67 33.21,16.15 v33.01,15.94
IO19
  Top 0.203: U3.25 25.33,23.55 R20.1
IO20
  Top 0.203: U3.26 24.59,23.38 R21.1
IO21
  Top 0.203: U3.27 24.04,23.4 24.04,24.07 23.4,24.72 FB1.1
IO38  (via drill 0.3)
  Top 0.203: R9.2 15.74,34.61 v16.27,35.15 | v16.27,18.43 16.37,18.33 18.16,18.33 U3.43
  Top 0.406: R14.2 R9.2
  Bottom 0.203: v16.27,18.43 16.12,18.59 16.12,34.99 v16.27,35.15
IO39  (via drill 0.3)
  Top 0.203: U3.44 18.27,17.62 17.59,17.62 v17.44,17.77 | P2.17 21.97,39.6 v22.14,39.77
  Bottom 0.203: v22.14,39.77 22.14,39.57 21.15,38.58 17.79,38.58 17.21,37.99 17.21,34.56 16.93,34.28 16.93,19.22 17.21,18.94 17.21,18 v17.44,17.77
IO40  (via drill 0.3)
  Top 0.203: U3.45 18.43,17.21 17.06,17.21 v16.73,17.54 | P2.19 21.57,40.05 v21.53,40.1
  Bottom 0.203: v21.53,40.1 21.5,40.07 21.5,39.49 21,38.98 17.26,38.98 16.8,38.52 16.8,34.84 16.52,34.56 16.52,18.99 16.8,18.71 16.8,17.62 v16.73,17.54
IO41  (via drill 0.3)
  Top 0.203: U3.47 18.72,16.38 v15.81,16.38 | P2.21 21.17,39.46 v20.92,39.72
  Bottom 0.203: v15.81,16.38 15.71,16.48 15.71,38.07 17.03,39.39 20.59,39.39 v20.92,39.72
IO42  (via drill 0.3)
  Top 0.203: U3.48 18.96,16.05 18.83,15.92 18.65,15.74 v15.33,15.74 | P2.25 20.37,40.14 v20.46,40.23
  Bottom 0.203: v20.46,40.23 20.03,39.79 16.83,39.79 15.28,38.24 15.28,15.79 v15.33,15.74
IO45/DE  (via drill 0.3)
  Top 0.203: 18.33,14.14 18.75,14.14 U3.51 19.08,14.47 | R11.1 18.2,14.14 18.33,14.14 | P2.27 19.97,40.13 v19.67,40.43 | v18.46,14.27 18.33,14.14
  Bottom 0.203: 19.52,40.28 v19.67,40.43 19.5,40.25 16.55,40.25 14.77,38.47 14.77,15.18 15.69,14.27 v18.46,14.27
IO46  (via drill 0.3)
  Top 0.203: U3.52 18.47,13.3 v17.97,13.3 | P2.29 19.57,39.57 18.91,40.23 v18.91,40.78
  Bottom 0.203: v17.97,13.3 15.89,13.3 14.32,14.88 14.32,38.91 16.19,40.78 v18.91,40.78
IO47  (via drill 0.3)
  Top 0.203: U3.37 19.2,21.25 v18.3,21.25 | P2.15 22.37,39.06 v22.52,39.21
  Bottom 0.203: v22.52,39.21 21.48,38.17 18.3,38.17 17.62,37.48 17.62,34.31 17.34,34.03 17.34,22.22 v18.3,21.25
IO48  (via drill 0.3)
  Top 0.203: U3.36 18.98,22.04 v18.63,22.04 | P2.13 22.77,38.55 v22.93,38.7
  Bottom 0.203: v22.93,38.7 21.99,37.76 18.53,37.76 18,37.23 18,34.08 17.74,33.83 17.74,22.93 v18.63,22.04
LCD_RST  (via drill 0.3)
  Top 0.203: P2.31 19.17,37.25 19.34,37.08 26.35,37.08 v26.51,37.23 | R2.1 R4.1 28.97,35.08 C36.2 v29.57,35.08 v29.56,35.1
  Bottom 0.203: v26.51,37.23 26.51,36.92 28.34,35.1 v29.56,35.1
LED+  (via drill 0.3)
  Top 0.203: P2.34 18.57,36.33 18.86,36.62 26.61,36.62 v27.19,37.2 | R5.2 R6.2 v29.48,37.69
  Bottom 0.203: v27.19,37.2 29,37.2 v29.48,37.69
LED-
  Top 0.203: P2.33 18.77,38.51 16.58,40.71 Q2.3
N$1
  Top 0.203: L4.2 arc-90 24.78,9.78 24.78,10.03 24.79,10.03 arc-90 C18.2
  Top 0.508: ANT1.FEED 25.75,7.36 | L1.1 24.12,10.74
  Top 0.762: C18.2 arc-39 25.75,7.36 arc39 C18.2 | 24.12,10.74 C18.2
N$2
  Top 0.203: U3.1 23.09,14.13 | 23.09,14.13 arc90 23.1,14.11 | 22.87,13.89 22.85,13.89 22.85,14.57 22.95,14.67 22.95,14.13 23.09,14.13
  Top 0.508: L1.2 23.13,11.75
  Top 0.762: 23.1,14.11 arc-90 23.12,14.1 C5.2 23.12,11.74 23.13,11.75 23.1,11.75
N$3
  Top 0.203: U3.35 18.96,22.62 17.73,22.62 R28.2
N$4  (1 unrouted)
  Top 0.305: C8.2 26.25,9.57
N$5
  pour Top: 25.9,6.44 25.9,7.1 25.59,7.1 25.59,6.42 25.9,6.42
N$6
  Top 0.203: 14.44,35.13 R14.1
  Top 0.406: R14.1 15.22,35.68 R17.2 | R10.1 14.44,35.13
N$7
  Top 0.254: R1.2 PWR.-
N$8
  Top 0.203: 14.33,38.54 Q2.1
  Top 0.406: R17.1 R3.2 14.33,38.54
N$9
  Top 0.203: USB2.A5 34.2,30.17 R30.1
N$10
  Top 0.203: USB2.B5 37.44,35.54 R29.1
N$33  (1 unrouted)
  Top 0.203: U3.3 | U3.3 24.7,14.05 C4.2 25.54,13.23 L2.2 | 23.26,14.95 23.51,15.21 24.37,14.34 24.73,14.34 25.85,13.23 25.54,12.92 25.29,12.92 | 25.29,12.92 25.21,13 | 25.21,13 23.33,14.88 23.38,14.88 U3.2 | 23.46,15 25.21,13.25 25.21,13 | 25.29,12.92 25.47,12.74 25.69,12.74 25.69,12.87 24.83,13.73 25.01,13.91 25.52,13.4
N$35
  Top 0.203: U3.34 18.81,23.34 R16.2
N$37
  Top 0.203: U3.54 18.53,12.23 18.53,10.51 17.19,9.16 R34.2
N$38
  Top 0.203: U3.33 18.29,24.43 R18.2
N$40
  Top 0.203: U3.31 17.99,25.85 R23.2
N$41
  Top 0.203: U3.30 17.42,26.99 R25.2
N$63
  Top 0.203: U3.49 18.73,15.26 14.94,15.26 R12.2
N$65
  Top 0.203: U3.53 17.85,12.11 C13.2 | C13.2 | C13.2 X1.3
N$66  (1 unrouted)
  Top 0.203: 14.51,10.2 X1.1 | R34.1 C19.1 14.47,9.38 14.47,10.13 14.49,10.15 14.49,10.2
N$76
  Top 0.61: U5.4 30.76,29.01 C7.2
PCLK
  Top 0.203: P2.6 24.17,34.56 24.73,34 25.59,34 26.1,33.5 26.1,27.59 25.49,26.98 C24.1 24.24,26.34 FB1.2
RESET  (via drill 0.3)  (1 unrouted)
  Top 0.203: R15.1 C10.2 8.05,32.88 RST.2 | R2.2 28.07,33.53 28.34,33.27 v28.92,33.27 | U3.4 24.31,15 24.6,15 25.16,15.56 25.41,15.56 25.9,15.08 v26.91,15.08
  Bottom 0.203: v8.07,32.45 9.79,30.73 9.79,13.48 11.52,11.75 19.12,11.75 22.32,14.95 27.04,14.95 | v28.92,33.27 29.2,32.99 29.2,27.32 33.67,22.85 33.67,15.28 33.34,14.95 27.04,14.95 | v26.91,15.08 27.04,14.95
SPICLK  (via drill 0.3)
  Top 0.305: R18.1 16.41,24.53 v11.42,24.53 | U4.6 v12,22.17
  Bottom 0.305: v12,22.17 11.42,22.75 v11.42,24.53
SPICS0  (via drill 0.3)
  Top 0.203: U3.32 18.14,25.14 v12.87,25.14 | U4.1 14.54,28.67
  Top 0.305: U4.1 14.54,28.24 14.11,27.81 13.12,27.81 12.87,27.55 v12.87,27.04
  Bottom 0.203: v12.87,27.04 v12.87,25.14
SPID
  Top 0.305: R28.1 15.79,22.24 14.59,23.44 11.32,23.44 10.73,22.85 U4.5
SPIHD  (via drill 0.3)
  Top 0.305: R25.1 16.14,26.99 15.56,26.41 v12.23,26.41 | U4.7 13.15,21.29 13.15,21.86 12.64,22.37 v12.64,22.73
  Bottom 0.305: v12.23,26.41 12.23,23.13 v12.64,22.73
SPIQ  (via drill 0.3)
  Top 0.305: R16.1 15.74,23.34 15.13,23.94 v10.73,23.94 | U4.2 v13.27,30.37
  Bottom 0.305: v13.27,30.37 13.27,28.52 10.73,25.98 v10.73,23.94
SPIWP
  Top 0.305: R23.1 16.46,25.8 11.62,25.8 11.39,26.03 11.39,26.81 12,27.42 U4.3
TP_INT  (via drill 0.3)
  Top 0.203: P2.1 25.17,38.43 25.47,38.73 v25.72,38.73 | R26.1 v10.4,27.91
  Bottom 0.203: v25.72,38.73 25.72,40 24.4,41.32 15.97,41.32 13.81,39.16 13.81,32.2 10.4,28.8 v10.4,27.91
TP_RST  (via drill 0.3)
  Top 0.203: P2.4 24.57,34.79 24.78,34.59 v25.29,34.59 | R9.1 15.76,33.33 | C26.2 18.37,33.33 v18.38,33.32
  Top 0.406: R8.1 14.85,33.36 R9.1 | 15.76,33.33 C26.2
  Bottom 0.203: v25.29,34.59 24.02,33.32 v18.38,33.32
U0RXD  (via drill 0.3)
  Top 0.203: U3.50 18.89,14.85 14.16,14.85 12.79,13.48 10.76,13.48 v10.53,13.71 | 8.67,16.43 J2.3
  Top 0.406: 8.67,16.43 v10.53,16.43 12,16.43 RX.T
  Bottom 0.406: v10.53,16.43 v10.53,13.71
U0TXD
  Top 0.406: R12.1 12.5,14.57 TX.T 11.95,14.57 11.37,15.16 J2.4
USB_D+  (via drill 0.3)
  Top 0.203: R21.2 26.51,26.56 26.51,29.48 29.28,32.25 v29.78,32.25 | v29.78,31.13 v33.95,31.13 34.46,31.13 USB2.A6 | USB2.B6 36.95,34.33 v37.15,34.33
  Bottom 0.203: v29.78,32.25 v29.78,31.13 | v37.15,34.33 v33.95,31.13
USB_D-
  Top 0.203: R20.2 26.91,25.49 26.91,29.2 29.38,31.67 34.28,31.67 USB2.A7 35.5,32.89 36.21,32.89 36.54,33.22 36.57,33.22 36.62,33.27 USB2.B7
VDD_SPI  (via drill 0.3)
  Top 0.203: U3.29 20.6,24.37 C12.2 | C37.2 19.64,26.16 19.64,26
  Top 0.61: C12.2 19.64,26 17.71,27.93 15.79,27.93 14.98,27.12 v13.63,27.12 | U4.8 14.54,22.37 14.19,22.73 v13.63,22.73
  Bottom 0.61: v13.63,22.73 v13.63,27.12

### Text on the board
tPlace: GND | +3.3V | RXD | TXD | IO18/SCL | +3V3 | IO17/SDA | GND
bPlace: ESP32-S3 Parallel | TFT with Touch | 2.1" ST7701 v1.1 | www.makerfabs.com